# Altium schematic sheet Light Control - 6ports Ext Board.SchDoc: Light Control Ext Board (for 6 port|)
size A4; Revision: 1.0; SheetNumber: 2; ProjectName: Light Control
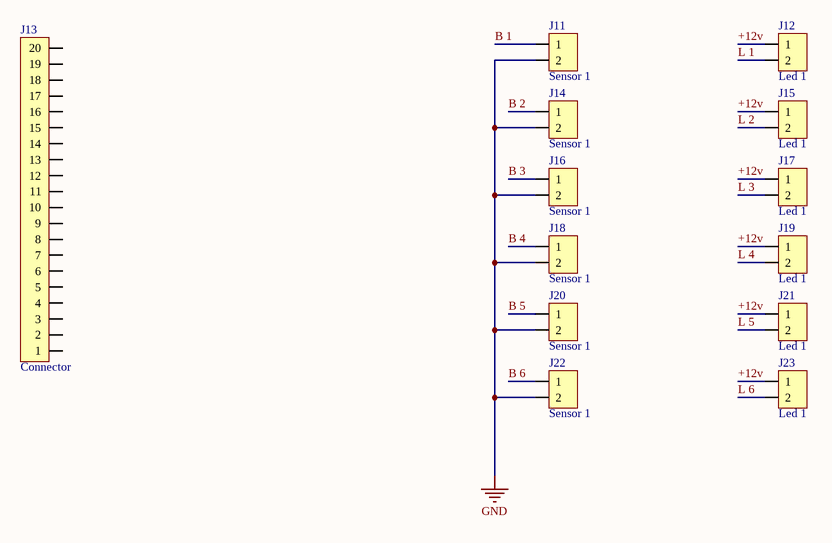
[diagram p0: Light Control - 6ports Ext Board.SchDoc]

## Parts
J11  Sensor 1  [DG301 5mm 2p]
J12  Led 1  [DG301 5mm 2p]
J13  Connector  [LINE 2.54 x 20D (2 x 10) - BH]
J14  Sensor 1  [DG301 5mm 2p]
J15  Led 1  [DG301 5mm 2p]
J16  Sensor 1  [DG301 5mm 2p]
J17  Led 1  [DG301 5mm 2p]
J18  Sensor 1  [DG301 5mm 2p]
J19  Led 1  [DG301 5mm 2p]
J20  Sensor 1  [DG301 5mm 2p]
J21  Led 1  [DG301 5mm 2p]
J22  Sensor 1  [DG301 5mm 2p]
J23  Led 1  [DG301 5mm 2p]

## Nets
GND: J11.2 J14.2 J16.2 J18.2 J20.2 J22.2
+12v: J12.1 J15.1 J17.1 J19.1 J21.1 J23.1
B 1: J11.1
B 2: J14.1
B 3: J16.1
B 4: J18.1
B 5: J20.1
B 6: J22.1
L 1: J12.2
L 2: J15.2
L 3: J17.2
L 4: J19.2
L 5: J21.2
L 6: J23.2

Not connected (* = marked no-connect by the designer): J13 1 2 3 4 5 6 7 8 9 10 11 12 13 14 15 16 17 18 19 20

## Notes on the sheet
- Title
- Size:
- Date:
- A4
- Number:
- Time:
- Revision:
- Sheet
- of
- File:

## Library data of the parts
J11 J12 J14-J23 = DG301-5.0-2P12: DG301 series
J13 = PLD-20 (2 x 10): Vert, Dbl line, Male